# Altium project Q24_Harness.PrjPcb
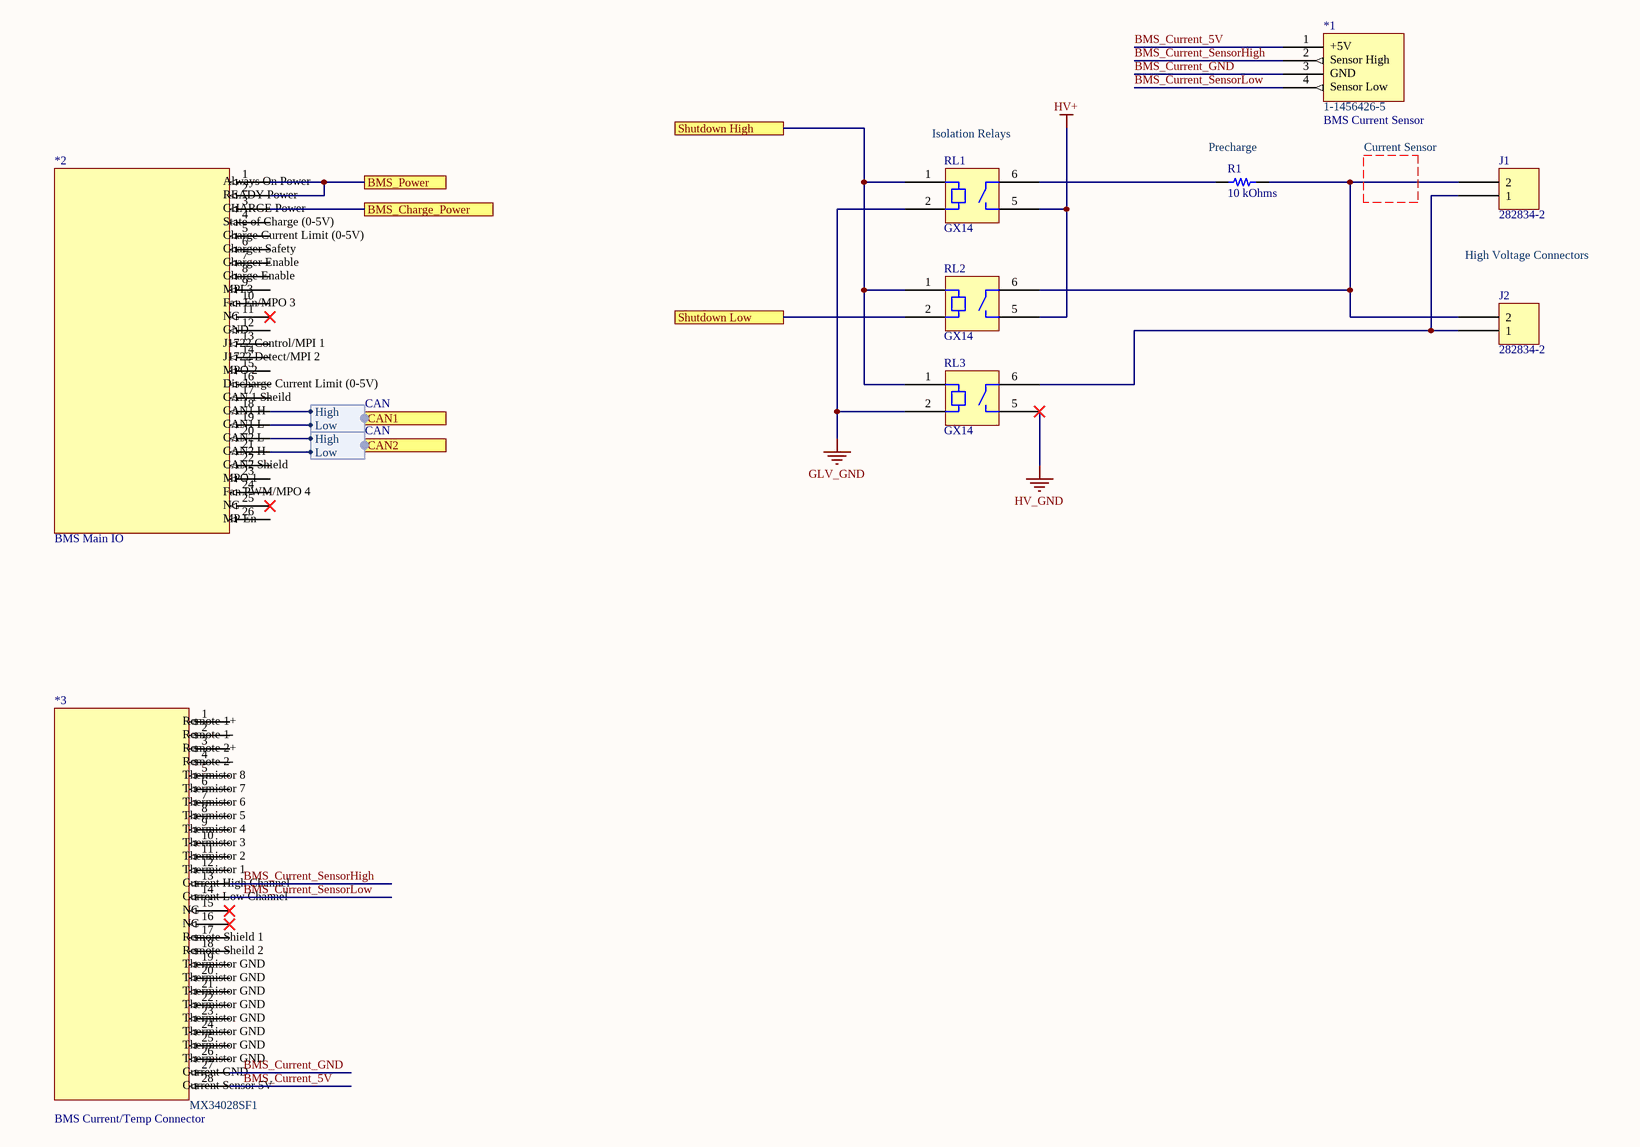
[diagram p0: Accumulator.SchDoc]
1 sheet, 9 parts. Net scope: flat (ports and power ports of the same name join across sheets).

## Sheet Accumulator.SchDoc: Title
size A3; Date: *******; ApprovedBy: *******; CheckedBy: None; Author: *******; CompanyName: *******; DrawnBy: Jacob Chisholm; Engineer: *******; Organization: *******; Address1: *******; Address2: *******; Address3: *******; Address4: *******; DocumentNumber: 1; Revision: *******; SheetNumber: 1; SheetTotal: 1; Address_Website: https://jchisholm204.github.io; E-Mail: JacobChisholm1010@gmail.com; CurrentTime: *******; CurrentDate: *******; Time: *******; DocumentFullPathAndName: *******; DocumentName: *******; ModifiedDate: *******; ImagePath: *******; ProjectName: *******; Application_BuildNumber: *******

### Parts
*1  BMS Current Sensor
*2  BMS Main IO
*3  BMS Current/Temp Connector
J1  282834-2  [TE 282834-2]
J2  282834-2  [TE 282834-2]
R1  10 kOhms  [RES 0603_1608]
RL1  GX14  [PANASONIC APAN31nn PA-N]
RL2  GX14  [PANASONIC APAN31nn PA-N]
RL3  GX14  [PANASONIC APAN31nn PA-N]

### Ports
BMS_Charge_Power, BMS_Power, CAN1 (harness CAN), CAN2 (harness CAN), Shutdown High, Shutdown Low

### Harnesses
CAN: High, Low

### Nets
GLV_GND: RL1.2(COIL2) RL3.2(COIL2)
HV+: RL1.5(TERM1) RL2.5(TERM1)
HV_GND: RL3.5(TERM1)
BMS_Current_5V: *1.1 *3.28
BMS_Current_GND: *1.3 *3.27
BMS_Current_SensorHigh: *1.2 *3.13
BMS_Current_SensorLow: *1.4 *3.14
Net*2_1: *2.1 *2.2 ; port BMS_Power
Net*2_3: *2.3 ; port BMS_Charge_Power
Net*2_18: *2.18 ; port CAN1.High
Net*2_19: *2.19 ; port CAN1.Low
Net*2_20: *2.20 ; port CAN2.High
Net*2_21: *2.21 ; port CAN2.Low
NetJ1_1: J1.1 J2.1 RL3.6(TERM2)
NetJ1_2: J1.2 J2.2 R1.1 RL2.6(TERM2)
NetR1_2: R1.2 RL1.6(TERM2)
NetRL1_1: RL1.1(COIL1) RL2.1(COIL1) RL3.1(COIL1) ; port Shutdown High
NetRL2_2: RL2.2(COIL2) ; port Shutdown Low

Not connected (* = marked no-connect by the designer): *2 4 5 6 7 8 9 10 11* 12 13 14 15 16 17 22 23 24 25* 26; *3 1 2 3 4 5 6 7 8 9 10 11 12 15* 16* 17 18 19 20 21 22 23 24 25 26

### Notes on the sheet
- (near RL1) Isolation Relays
- (near R1) Precharge
- Current Sensor
- High Voltage Connectors
- Title:
- Drawn By:
- Page Contents:
- Checked By:
- Size:
- Date:
- File:
- License:
- Email:
- A3
- Number:
- Time:
- Revision:
- Sheet
- Website:
- of
- (in symbol CMP-002-00073-1) Always On Power; READY Power; CHARGE Power; State of Charge (0-5V); Charge Current Limit (0-5V); Charger Safety; Charger Enable; Charge Enable; MPI 3; Fan En/MPO 3; NC; GND; J1722 Control/MPI 1; J1722 Detect/MPI 2; MPO 2; Discharge Current Limit (0-5V); CAN 1 Sheild; CAN1 H; CAN1 L; CAN2 L; CAN2 H; CAN2 Shield; MPO 1; Fan PWM/MPO 4; MP En
- (in symbol CMP-00014-1) Remote 1+; Remote 1-; Remote 2+; Remote 2-; Thermistor 8; Thermistor 7; Thermistor 6; Thermistor 5; Thermistor 4; Thermistor 3; Thermistor 2; Thermistor 1; Current High Channel; Current Low Channel; NC; Remote Shield 1; Remote Sheild 2; Thermistor GND; Current GND; Current Sensor 5V; MX34028SF1
- (in symbol CMP-00015-1) +5V; Sensor High; GND; Sensor Low; 1-1456426-5

### Library data of the parts
*1 = CMP-00015-1: 1-1456426-5  Combination Line Connector, 4 Contact(s), Female, Receptacle; Reach SVHC Compliant: Yes; Contact Finish - Mating: NOT SPECIFIED; Connector Type: COMBINATION LINE CONNECTOR; RoHS Compliant: Yes
*2 = CMP-002-00073-1: 1376360-1 Combination Line Connector, 26 Contact(s), Female, Crimp Terminal, Plug; Connector Type: COMBINATION LINE CONNECTOR; RoHS Compliant: Yes
*3 = CMP-00014-1: Combination Line Connector, 28 Contact(s), Female; Number of Contacts: 28; Filter Feature: No; Option: General Purpose; RoHS Compliant: Yes; Contact Gender: Female; MIL Conformance: No; Contact Finish - Mating: NOT SPECIFIED; Mixed Contacts: No; Connector Type: COMBINATION LINE CONNECTOR; Reach SVHC Compliant: Yes; Mounting Technology: Cable; IEC Conformance: No; Shell Material: POLYAMIDE66; Empty Shell: No; DIN Conformance: No
J1 J2 = 282834-2: TERM BLK 2P SIDE ENT 2.54MM PCB; Manufacturer: TE Connectivity AMP Connectors; Current: 10A; Mating Orientation: Horizontal with Board; Number of Levels: 1; Pitch: 0.100" (2.54mm); Positions Per Level: 2; Voltage: 150V; Wire Gauge: 16-30 AWG; Wire Termination: Screw - Rising Cage Clamp; Part Number: 282834-2; Color: Green; ComponentLink1Description: Datasheet; ComponentLink1URL: https://www.te.com/commerce/DocumentDelivery/DDEController?Action=srchrtrv&DocNm=282834&DocType=Customer+Drawing&DocLang=English; ComponentLink2Description: DigiKey Link; ComponentLink2URL: http://digikey.com/product-detail/en/te-connectivity-amp-connectors/282834-2/A98333-ND/1150135; LastUpdated: 1/15/2020 4:15:38 AM; Lifecycle Status: Active; Minimum Order: 1; Mounting Type: Through Hole; Packaging: Bulk; Part Status: Active; Price: 0.88; Series: Buchanan; Supplier 1: DigiKey; Supplier Part Number 1: A98333-ND
R1 = APC0603B10K0N: 1/16 WATTS PRECISION CHIP 10 KIL; Manufacturer: Ohmite; Power (Watts): 0.063W, 1/16W; Temperature Coefficient: ±25ppm/°C; Tolerance: ±0.1%; Part Number: APC0603B10K0N; Value: 10 kOhms; ComponentLink1Description: Datasheet; ComponentLink1URL: https://www.ohmite.com/assets/docs/APC-1-15.34.pdf; ComponentLink2Description: DigiKey Link; ComponentLink2URL: https://www.digikey.com/en/products/detail/ohmite/APC0603B10K0N/16369646; Composition: Thin Film; Device Package: 0603 (1608 Metric); Height - Seated (Max): 0.022" (0.55mm); LastUpdated: 2/9/2024 8:40:41 PM; Lifecycle Status: Active; Minimum Order: 1; Number of Terminations: 2; Operating Temperature: -55°C ~ 155°C; Package / Case: 0603 (1608 Metric); Packaging: TapeAndReel; PartId: 77923; Part Status: Active; Price: 0.05; Resistance: 10 kOhms; Series: APC; Size / Dimension: 0.061" L x 0.031" W (1.55mm x 0.80mm); Supplier 1: DigiKey; Supplier Part Number 1: 273-APC0603B10K0NCT-ND; Supplier Device Package: 0603
RL1-RL3 = APAN3105: RELAY GENERAL PURPOSE SPST 5A 5V; Manufacturer: Panasonic Electric Works; Coil Current: 22mA; Coil Type: Non Latching; Coil Voltage: 5VDC; Contact Form: SPST-NO (1 Form A); Must Operate Voltage: 3.5 VDC; Must Release Voltage: 0.25 VDC; Operate Time: 10ms; Release Time: 5ms; Seal Rating: Sealed - Fully; Switching Voltage: 250VAC, 110VDC - Max; Part Number: APAN3105; ComponentLink1Description: Datasheet; ComponentLink1URL: //media.digikey.com/pdf/Data%20Sheets/Panasonic%20Electric%20Works%20PDFs/PA-N_Series.pdf; ComponentLink2Description: DigiKey Link; ComponentLink2URL: http://digikey.com/product-detail/en/panasonic-electric-works/APAN3105/255-5324-5-ND/6009007; Contact Material: Silver Nickel (AgNi), Gold (Au); Contact Rating (Current): 5A; LastUpdated: 8/16/2023 4:44:09 PM; Lifecycle Status: Active; Minimum Order: 1; Mounting Type: Through Hole; Operating Temperature: -40°C ~ 90°C; Packaging: Tube; Part Status: Active; Price: 5.50; Relay Type: General Purpose; Series: PA-N; Supplier 1: DigiKey; Supplier Part Number 1: 255-5324-5-ND; Termination Style: PC Pin